# Altium schematic sheet fpga-ddr-to-ddr-map.SchDoc
size Letter; CheckedBy: E. Chiu; CompanyName: Brinton Engineering, LLC; DrawnBy: J. Brinton; Engineer: J. Brinton; Address1: 3479 Edison Way; Address2: Menlo Park CA 94025; Address3: +1 (877) 778-8435; Address4: brintonengineering.com; Revision: 1; SheetNumber: 6; SheetTotal: 48
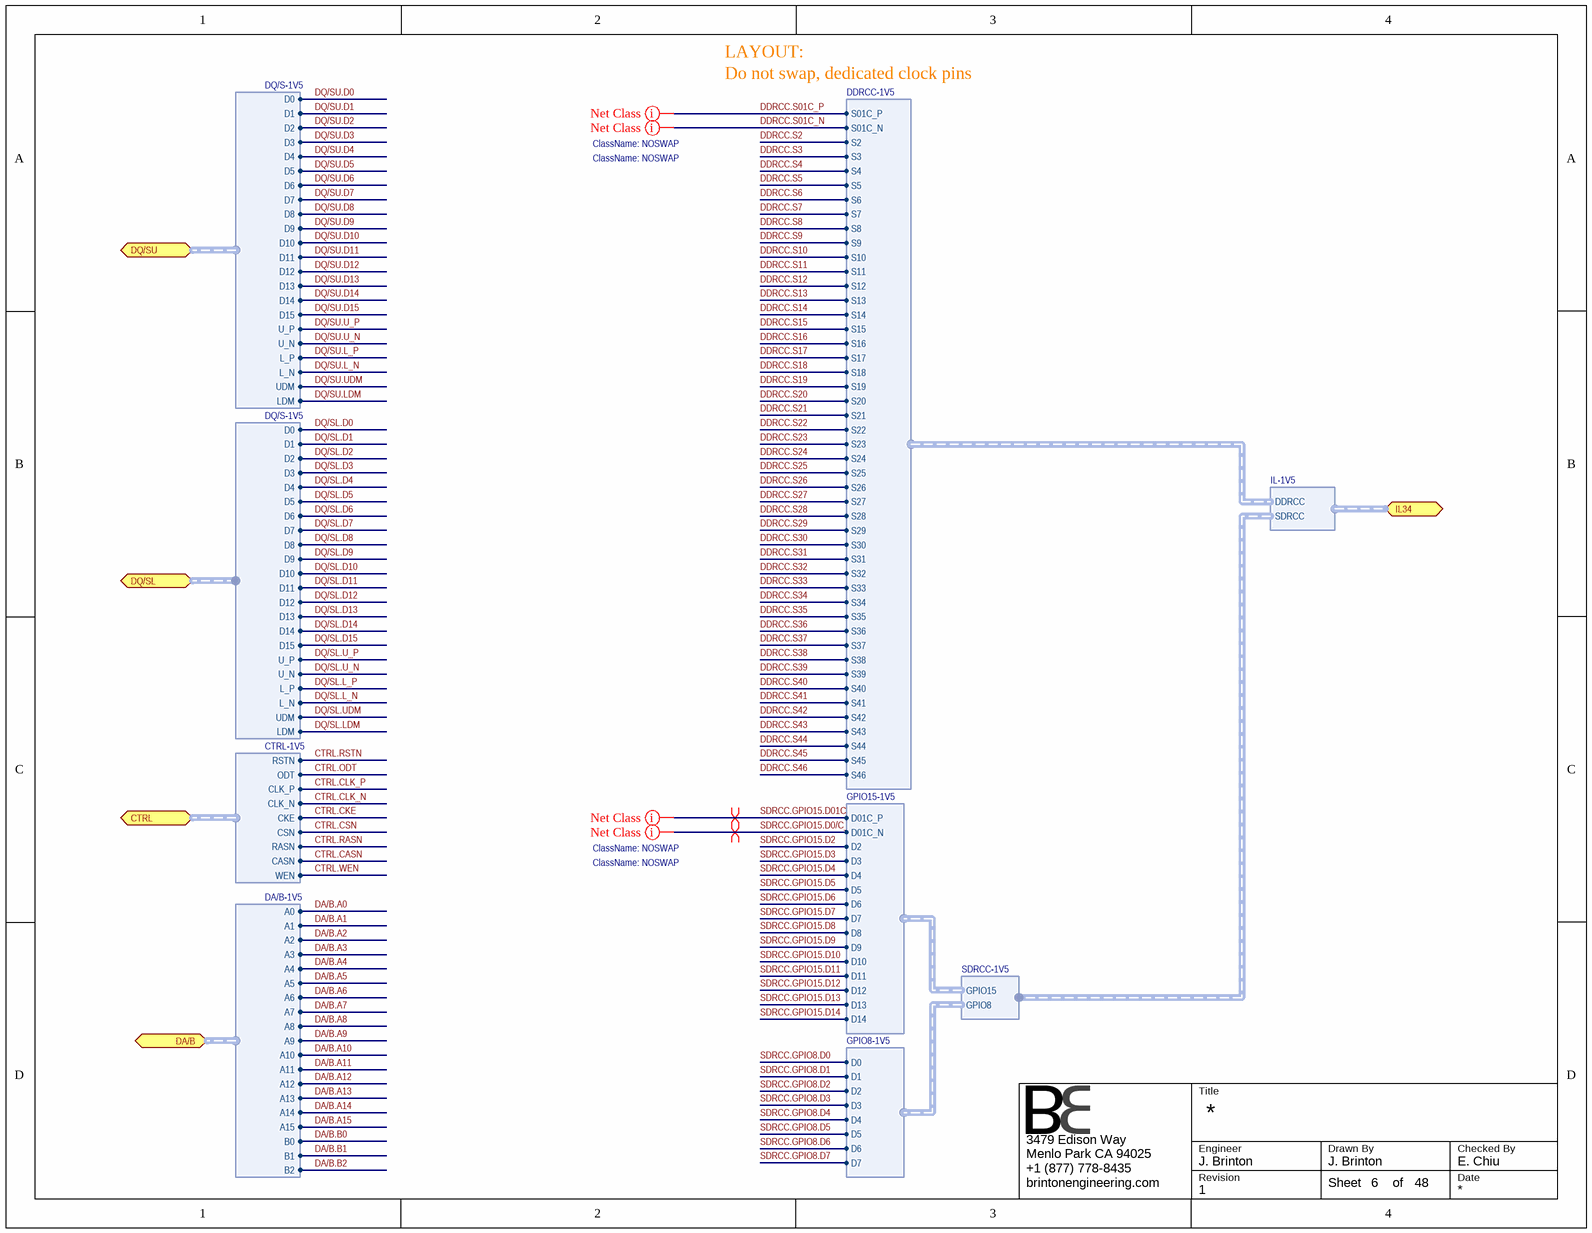
[diagram p0: fpga-ddr-to-ddr-map.SchDoc]

## Ports
CTRL (harness CTRL-1V5), DA/B (harness DA/B-1V5), DQ/SL (harness DQ/S-1V5), DQ/SU (harness DQ/S-1V5), IL34 (harness IL-1V5)

## Harnesses
IL-1V5: DDRCC, SDRCC
DQ/S-1V5: D0, D1, D2, D3, D4, D5, D6, D7, D8, D9, D10, D11, D12, D13, D14, D15, U_P, U_N, L_P, L_N, UDM, LDM
CTRL-1V5: RSTN, CLK_P, CLK_N, CKE, CSN, RASN, CASN, WEN, ODT
DA/B-1V5: A0, A1, A2, A3, A4, A5, A6, A7, A8, A9, A10, A11, A12, A13, A14, A15, B0, B1, B2
DDRCC-1V5: S01C_P, S01C_N, S2, S3, S4, S5, S6, S7, S8, S9, S10, S11, S12, S13, S14, S15, S16, S17, S18, S19, S20, S21, S22, S23, S24, S25, S26, S27, S28, S29, S30, S31, S32, S33, S34, S35, S36, S37, S38, S39, S40, S41, S42, S43, S44, S45, S46
GPIO8-1V5: D0, D1, D2, D3, D4, D5, D6, D7
GPIO15-1V5: D01C_P, D01C_N, D2, D3, D4, D5, D6, D7, D8, D9, D10, D11, D12, D13, D14
SDRCC-1V5: GPIO15, GPIO8

## Nets
CTRL.CASN: port CTRL.CASN
CTRL.CKE: port CTRL.CKE
CTRL.CLK_N: port CTRL.CLK_N
CTRL.CLK_P: port CTRL.CLK_P
CTRL.CSN: port CTRL.CSN
CTRL.ODT: port CTRL.ODT
CTRL.RASN: port CTRL.RASN
CTRL.RSTN: port CTRL.RSTN
CTRL.WEN: port CTRL.WEN
DA/B.A0: port DA/B.A0
DA/B.A1: port DA/B.A1
DA/B.A2: port DA/B.A2
DA/B.A3: port DA/B.A3
DA/B.A4: port DA/B.A4
DA/B.A5: port DA/B.A5
DA/B.A6: port DA/B.A6
DA/B.A7: port DA/B.A7
DA/B.A8: port DA/B.A8
DA/B.A9: port DA/B.A9
DA/B.A10: port DA/B.A10
DA/B.A11: port DA/B.A11
DA/B.A12: port DA/B.A12
DA/B.A13: port DA/B.A13
DA/B.A14: port DA/B.A14
DA/B.A15: port DA/B.A15
DA/B.B0: port DA/B.B0
DA/B.B1: port DA/B.B1
DA/B.B2: port DA/B.B2
DDRCC.S01C_N: harness DDRCC-1V5.S01C_N
DDRCC.S01C_P: harness DDRCC-1V5.S01C_P
DDRCC.S2: harness DDRCC-1V5.S2
DDRCC.S3: harness DDRCC-1V5.S3
DDRCC.S4: harness DDRCC-1V5.S4
DDRCC.S5: harness DDRCC-1V5.S5
DDRCC.S6: harness DDRCC-1V5.S6
DDRCC.S7: harness DDRCC-1V5.S7
DDRCC.S8: harness DDRCC-1V5.S8
DDRCC.S9: harness DDRCC-1V5.S9
DDRCC.S10: harness DDRCC-1V5.S10
DDRCC.S11: harness DDRCC-1V5.S11
DDRCC.S12: harness DDRCC-1V5.S12
DDRCC.S13: harness DDRCC-1V5.S13
DDRCC.S14: harness DDRCC-1V5.S14
DDRCC.S15: harness DDRCC-1V5.S15
DDRCC.S16: harness DDRCC-1V5.S16
DDRCC.S17: harness DDRCC-1V5.S17
DDRCC.S18: harness DDRCC-1V5.S18
DDRCC.S19: harness DDRCC-1V5.S19
DDRCC.S20: harness DDRCC-1V5.S20
DDRCC.S21: harness DDRCC-1V5.S21
DDRCC.S22: harness DDRCC-1V5.S22
DDRCC.S23: harness DDRCC-1V5.S23
DDRCC.S24: harness DDRCC-1V5.S24
DDRCC.S25: harness DDRCC-1V5.S25
DDRCC.S26: harness DDRCC-1V5.S26
DDRCC.S27: harness DDRCC-1V5.S27
DDRCC.S28: harness DDRCC-1V5.S28
DDRCC.S29: harness DDRCC-1V5.S29
DDRCC.S30: harness DDRCC-1V5.S30
DDRCC.S31: harness DDRCC-1V5.S31
DDRCC.S32: harness DDRCC-1V5.S32
DDRCC.S33: harness DDRCC-1V5.S33
DDRCC.S34: harness DDRCC-1V5.S34
DDRCC.S35: harness DDRCC-1V5.S35
DDRCC.S36: harness DDRCC-1V5.S36
DDRCC.S37: harness DDRCC-1V5.S37
DDRCC.S38: harness DDRCC-1V5.S38
DDRCC.S39: harness DDRCC-1V5.S39
DDRCC.S40: harness DDRCC-1V5.S40
DDRCC.S41: harness DDRCC-1V5.S41
DDRCC.S42: harness DDRCC-1V5.S42
DDRCC.S43: harness DDRCC-1V5.S43
DDRCC.S44: harness DDRCC-1V5.S44
DDRCC.S45: harness DDRCC-1V5.S45
DDRCC.S46: harness DDRCC-1V5.S46
DQ/SL.D0: port DQ/SL.D0
DQ/SL.D1: port DQ/SL.D1
DQ/SL.D2: port DQ/SL.D2
DQ/SL.D3: port DQ/SL.D3
DQ/SL.D4: port DQ/SL.D4
DQ/SL.D5: port DQ/SL.D5
DQ/SL.D6: port DQ/SL.D6
DQ/SL.D7: port DQ/SL.D7
DQ/SL.D8: port DQ/SL.D8
DQ/SL.D9: port DQ/SL.D9
DQ/SL.D10: port DQ/SL.D10
DQ/SL.D11: port DQ/SL.D11
DQ/SL.D12: port DQ/SL.D12
DQ/SL.D13: port DQ/SL.D13
DQ/SL.D14: port DQ/SL.D14
DQ/SL.D15: port DQ/SL.D15
DQ/SL.L_N: port DQ/SL.L_N
DQ/SL.L_P: port DQ/SL.L_P
DQ/SL.LDM: port DQ/SL.LDM
DQ/SL.U_N: port DQ/SL.U_N
DQ/SL.U_P: port DQ/SL.U_P
DQ/SL.UDM: port DQ/SL.UDM
DQ/SU.D0: port DQ/SU.D0
DQ/SU.D1: port DQ/SU.D1
DQ/SU.D2: port DQ/SU.D2
DQ/SU.D3: port DQ/SU.D3
DQ/SU.D4: port DQ/SU.D4
DQ/SU.D5: port DQ/SU.D5
DQ/SU.D6: port DQ/SU.D6
DQ/SU.D7: port DQ/SU.D7
DQ/SU.D8: port DQ/SU.D8
DQ/SU.D9: port DQ/SU.D9
DQ/SU.D10: port DQ/SU.D10
DQ/SU.D11: port DQ/SU.D11
DQ/SU.D12: port DQ/SU.D12
DQ/SU.D13: port DQ/SU.D13
DQ/SU.D14: port DQ/SU.D14
DQ/SU.D15: port DQ/SU.D15
DQ/SU.L_N: port DQ/SU.L_N
DQ/SU.L_P: port DQ/SU.L_P
DQ/SU.LDM: port DQ/SU.LDM
DQ/SU.U_N: port DQ/SU.U_N
DQ/SU.U_P: port DQ/SU.U_P
DQ/SU.UDM: port DQ/SU.UDM
SDRCC.GPIO8.D0: harness GPIO8-1V5.D0
SDRCC.GPIO8.D1: harness GPIO8-1V5.D1
SDRCC.GPIO8.D2: harness GPIO8-1V5.D2
SDRCC.GPIO8.D3: harness GPIO8-1V5.D3
SDRCC.GPIO8.D4: harness GPIO8-1V5.D4
SDRCC.GPIO8.D5: harness GPIO8-1V5.D5
SDRCC.GPIO8.D6: harness GPIO8-1V5.D6
SDRCC.GPIO8.D7: harness GPIO8-1V5.D7
SDRCC.GPIO15.D0/C_N: harness GPIO15-1V5.D01C_N
SDRCC.GPIO15.D01C_P: harness GPIO15-1V5.D01C_P
SDRCC.GPIO15.D2: harness GPIO15-1V5.D2
SDRCC.GPIO15.D3: harness GPIO15-1V5.D3
SDRCC.GPIO15.D4: harness GPIO15-1V5.D4
SDRCC.GPIO15.D5: harness GPIO15-1V5.D5
SDRCC.GPIO15.D6: harness GPIO15-1V5.D6
SDRCC.GPIO15.D7: harness GPIO15-1V5.D7
SDRCC.GPIO15.D8: harness GPIO15-1V5.D8
SDRCC.GPIO15.D9: harness GPIO15-1V5.D9
SDRCC.GPIO15.D10: harness GPIO15-1V5.D10
SDRCC.GPIO15.D11: harness GPIO15-1V5.D11
SDRCC.GPIO15.D12: harness GPIO15-1V5.D12
SDRCC.GPIO15.D13: harness GPIO15-1V5.D13
SDRCC.GPIO15.D14: harness GPIO15-1V5.D14

## Layout directives
net class NOSWAP: DDRCC.S01C_N, DDRCC.S01C_P, SDRCC.GPIO15.D0/C_N, SDRCC.GPIO15.D01C_P
differential pair: SDRCC.GPIO15.D0/C_N, SDRCC.GPIO15.D01C_P

## Notes on the sheet
- Do not swap, dedicated clock pins
- LAYOUT:
- Title
- Engineer
- Revision
- Drawn By
- Checked By
- Date
- Sheet
- of